# EAGLE design usb2rs485 (EAGLE 5.12)
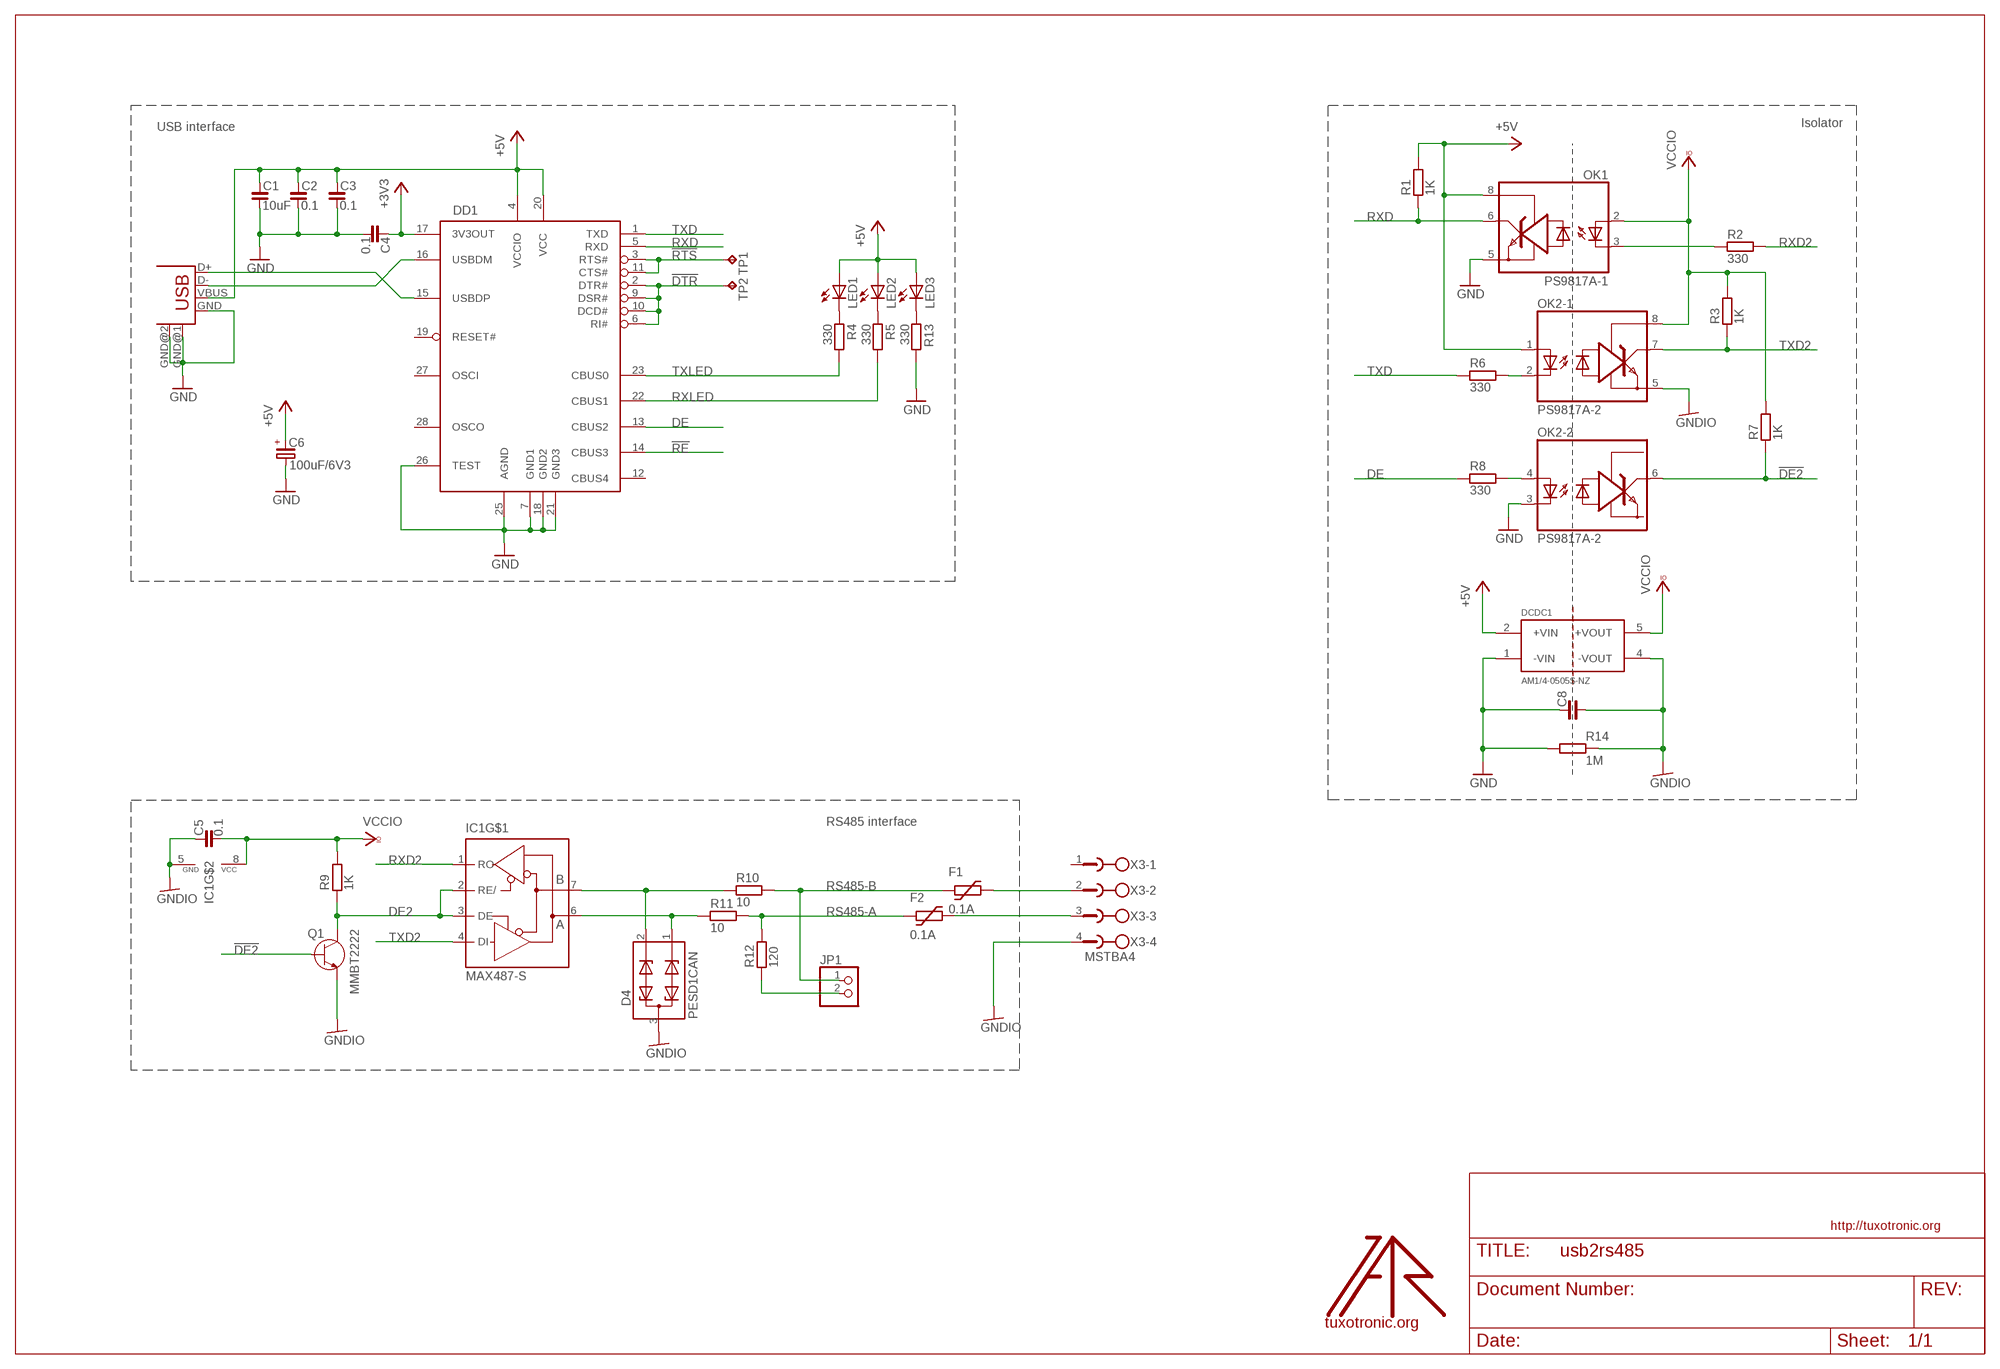
[diagram p0: schematic, sheet 1]

## Parts
C1  10uF  C_0805  [C0805]
C2  0.1  C_0603  [C0603]
C3  0.1  C_0603  [C0603]
C4  0.1  C_0603  [C0603]
C5  0.1  C_0603  [C0603]
C6  100uF/6V3  CP_SMCD  [SMC_D]
C8  C_C050-075X030  [C050-075X030]
D4  PESD1CAN  [SOT23]
DCDC1  AM1/4-0505S-NZ  [AM1/4]
DD1  FT232RL  [SSOP28DB]
F1  0.1A  1812L  [1812L]
F2  0.1A  1812L  [1812L]
IC1  MAX487-S  [SO08]
JP1  PINHD-1X2_2.00  [1X02M]
LED1  LEDCHIP-LED0805  [CHIP-LED0805]
LED2  LEDCHIP-LED0805  [CHIP-LED0805]
LED3  LEDCHIP-LED0805  [CHIP-LED0805]
OK1  PS9817A-1  [SO8F]
OK2  PS9817A-2  [SO8F]
Q1  MMBT2222  [SOT23]
R1  1K  R_0603  [R0603]
R2  330  R_0603  [R0603]
R3  1K  R_0603  [R0603]
R4  330  R_0603  [R0603]
R5  330  R_0603  [R0603]
R6  330  R_0603  [R0603]
R7  1K  R_0603  [R0603]
R8  330  R_0603  [R0603]
R9  1K  R_0603  [R0603]
R10  10  R_0805  [R0805]
R11  10  R_0805  [R0805]
R12  120  R_0805  [R0805]
R13  330  R_0603  [R0603]
R14  1M  R_1206  [R1206]
TP1  TPB1,27  [B1,27]
TP2  TPB1,27  [B1,27]
U$  LOGO  [TT_LOGO]
USB1  USB-B-H  [USB-B-H]
X3  MSTBA4  [MSTBA4]

## Nets
!DE2: OK2.6(-2:COL) Q1.1(B) R7.1
!DTR: DD1.2(DTR#) DD1.6(RI#) DD1.9(DSR#) DD1.10(DCD#) TP2.PP(TP)
!RE: DD1.14(CBUS3)
!RTS: DD1.3(RTS#) DD1.11(CTS#) TP1.PP(TP)
+3V3: C4.1 DD1.17(3V3OUT)
+5V: C1.1 C2.1 C3.1 C6.+ DCDC1.2(+VIN) DD1.4(VCCIO) DD1.20(VCC) LED1.A LED2.A LED3.A OK1.8(VDD) OK2.1(-1:A) R1.2 USB1.VBUS
DE: DD1.13(CBUS2) R8.1
DE2: IC1.2(RE/) IC1.3(DE) Q1.3(C) R9.1
GND: C1.2 C2.2 C3.2 C4.2 C6.- C8.1 DCDC1.1(-VIN) DD1.7(GND1) DD1.18(GND2) DD1.21(GND3) DD1.25(AGND) DD1.26(TEST) OK1.5(GND) OK2.3(-2:C) R13.2 R14.1 USB1.GND USB1.GND@1(GND) USB1.GND@2(GND)
GNDIO: C5.1 C8.2 D4.3 DCDC1.4(-VOUT) IC1.5(GND) OK2.5(-1:GND) Q1.2(E) R14.2 X3.4
N$1: DD1.15(USBDP) USB1.D+
N$2: DD1.16(USBDM) USB1.D-
N$3: LED1.C R4.1
N$4: LED2.C R5.1
N$5: F2.2 X3.3
N$6: F1.2 X3.2
N$7: OK2.4(-2:A) R8.2
N$8: OK2.2(-1:C) R6.2
N$9: OK1.3(C) R2.1
N$11: JP1.2 R12.1
N$15: LED3.C R13.1
N$27: D4.2 IC1.7(B) R10.1
N$28: D4.1 IC1.6(A) R11.1
RS485-A: F2.1 R11.2 R12.2
RS485-B: F1.1 JP1.1 R10.2
RXD: DD1.5(RXD) OK1.6(COL) R1.1
RXD2: IC1.1(RO) R2.2
RXLED: DD1.22(CBUS1) R5.2
TXD: DD1.1(TXD) R6.1
TXD2: IC1.4(DI) OK2.7(-1:COL) R3.1
TXLED: DD1.23(CBUS0) R4.2
VCCIO: C5.2 DCDC1.5(+VOUT) IC1.8(VCC) OK1.2(A) OK2.8(-1:VDD) R3.2 R7.2 R9.2
Unconnected: DD1.12(CBUS4) DD1.19(RESET#) DD1.27(OSCI) DD1.28(OSCO) X3.1

## Notes on the sheet
- Isolator
- USB interface
- RS485 interface

## Library data of the parts
C1-C5 = rc-master-smd:C_: NON-POLARIZED CAP
C6 = rc-master-smd:CP_: POLARIZED CAP
C8 = rc-master:C_: NON-POLARIZED CAP
D4 = protect:PESD1CAN: Features Due to the integrated diode structure only one small SOT23 package is needed to protect two CAN bus lines Max. peak pulse power: PPP = 200 W at tp = 8/20 ?s Low clamping voltage: VCL = 40 V at IPP = 1 A Ultra low leakage current: IRM < 1 nA ESD protection up to 23 kV IEC 61000-4-2, level 4 (ESD) IEC 61000-4-5 (surge); IPP = 3 A at tp = 8/20 ?s Small SMD plastic package Applications CAN bus protection Automotive applications
DCDC1 = dcdc-isolated:AM1/4-: AIMTEC: Series AM1/4L-NZ 1/4 Watt | DC-DC Converter RoHS Compliant SMD Package Low ripple and noise High efficiency up to 68% Operating temperature -40oC to + 85oC Input/Output Isolation 1000 and 3000VDC Pin compatible with multiple manufacturers UL94-VO Package
DD1 = main:FT232RL: USB UART 4th Generation USB UART (USB <-> Serial) Controller
F1 F2 = ptc-littlefuse:1812L
IC1 = interfaces:MAX487: RS485 TRANSEIVER
JP1 = pinhead-fixdrills:PINHD-1X2: PIN HEADER
LED1-LED3 = led:LED: LED OSRAM: - CHIPLED LG R971, LG N971, LY N971, LG Q971, LY Q971, LO R971, LY R971 LH N974, LH R974 LS Q976, LO Q976, LY Q976 LO Q996 - Hyper CHIPLED LW Q18S LB Q993, LB Q99A, LB R99A - SideLED LS A670, LO A670, LY A670, LG A670, LP A670 LB A673, LV A673, LT A673, LW A673 LH A674 LY A675 LS A676, LA A676, LO A676, LY A676, LW A676 LS A679, LY A679, LG A679 - Hyper Micro SIDELED® LS Y876, LA Y876, LO Y876, LY Y876 LT Y87S - SmartLED LW L88C, LW L88S LB L89C, LB L89S, LG L890 LS L89K, LO L89K, LY L89K LS L896, LA L896, LO L896, LY L896 - TOPLED LS T670, LO T670, LY T670, LG T670, LP T670 LSG T670, LSP T670, LSY T670, LOP T670, LYG T670 LG T671, LOG T671, LSG T671 LB T673, LV T673, LT T673, LW T673 LH T674 LS T676, LA T676, LO T676, LY T676, LB T676, LH T676, LSB T676, LW T676 LB T67C, LV T67C, LT T67C, LS T67K, LO T67K, LY T67K, LW E67C LS E67B, LA E67B, LO E67B, LY E67B, LB E67C, LV E67C, LT E67C LW T67C LS T679, LY T679, LG T679 LS T770, LO T770, LY T770, LG T770, LP T770 LB T773, LV T773, LT T773, LW T773 LH T774 LS E675, LA E675, LY E675, LS T675 LS T776, LA T776, LO T776, LY T776, LB T776 LHGB T686 LT T68C, LB T68C - Hyper Mini TOPLED® LB M676 - Mini TOPLED Santana® LG M470 LS M47K, LO M47K, LY M47K Source: http://www.osram.convergy.de - LUMILED® LXK2-PW12-R00, LXK2-PW12-S00, LXK2-PW14-U00, LXK2-PW14-V00 LXK2-PM12-R00, LXK2-PM12-S00, LXK2-PM14-U00 LXK2-PE12-Q00, LXK2-PE12-R00, LXK2-PE12-S00, LXK2-PE14-T00, LXK2-PE14-U00 LXK2-PB12-K00, LXK2-PB12-L00, LXK2-PB12-M00, LXK2-PB14-N00, LXK2-PB14-P00, LXK2-PB14-Q00 LXK2-PR12-L00, LXK2-PR12-M00, LXK2-PR14-Q00, LXK2-PR14-R00 LXK2-PD12-Q00, LXK2-PD12-R00, LXK2-PD12-S00 LXK2-PH12-R00, LXK2-PH12-S00 LXK2-PL12-P00, LXK2-PL12-Q00, LXK2-PL12-R00 Source: www.luxeon.com
OK1 = opto:PS9817A-1: The PS9817A-1 and PS9817A-2 are active-low type high-speed photocouplers that use a GaAlAs light-emitting diode on the input side and a photodetector IC that includes a photodiode and a signal processor on the same chip on the output side.
OK2 = opto:PS9817A-2: The PS9817A-1 and PS9817A-2 are active-low type high-speed photocouplers that use a GaAlAs light-emitting diode on the input side and a photodetector IC that includes a photodiode and a signal processor on the same chip on the output side.
Q1 = semiconductor:MMBT2222: General Purpose Transistors NPN Silicon Rating MMBT2222LT1G MMBT2222ALT1G Collector-Emitter Voltage (VCEO) 30 Vdc 40 Vdc Collector-Base Voltage (VCBO) 60 Vdc 75 Vdc Emitter-Base Voltage (VEBO) 5.0 Vdc 6.0 Vdc Collector Current Continuous (IC) 600 mAdc 1100 mAdc Collector Current Peak (ICM) 600 mAdc 1100 mAdc
R1-R14 = rc-master-smd:R_: RESISTOR
TP1 TP2 = testpad:TP: Test pad
U$ = logo:LOGO
USB1 = main:USB: USB Connectors
X3 = con-phoenix-508:MSTBA4: PHOENIX

## Board
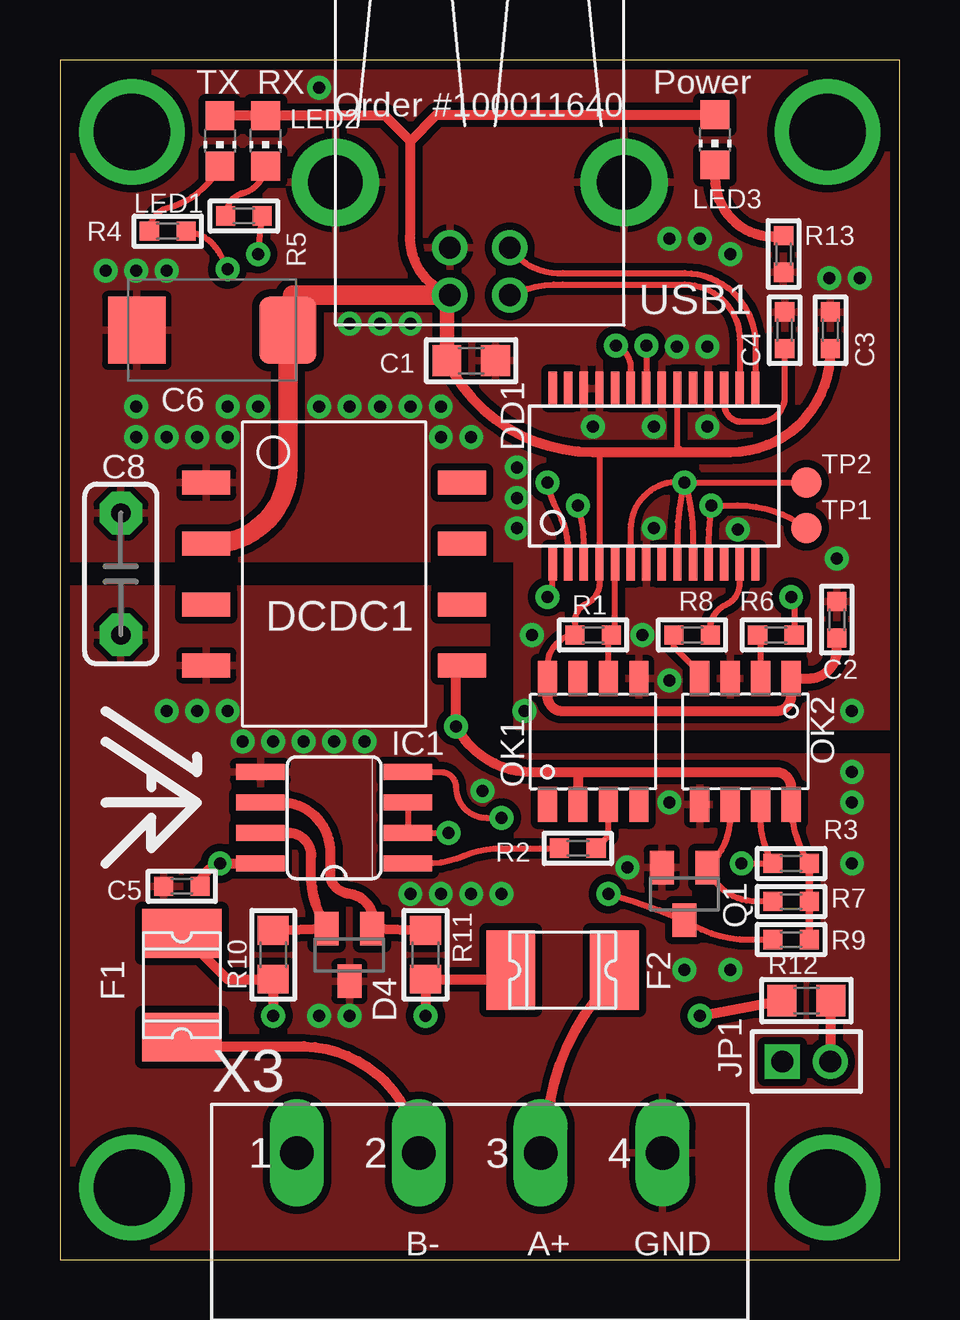
[diagram p1: board, top side]
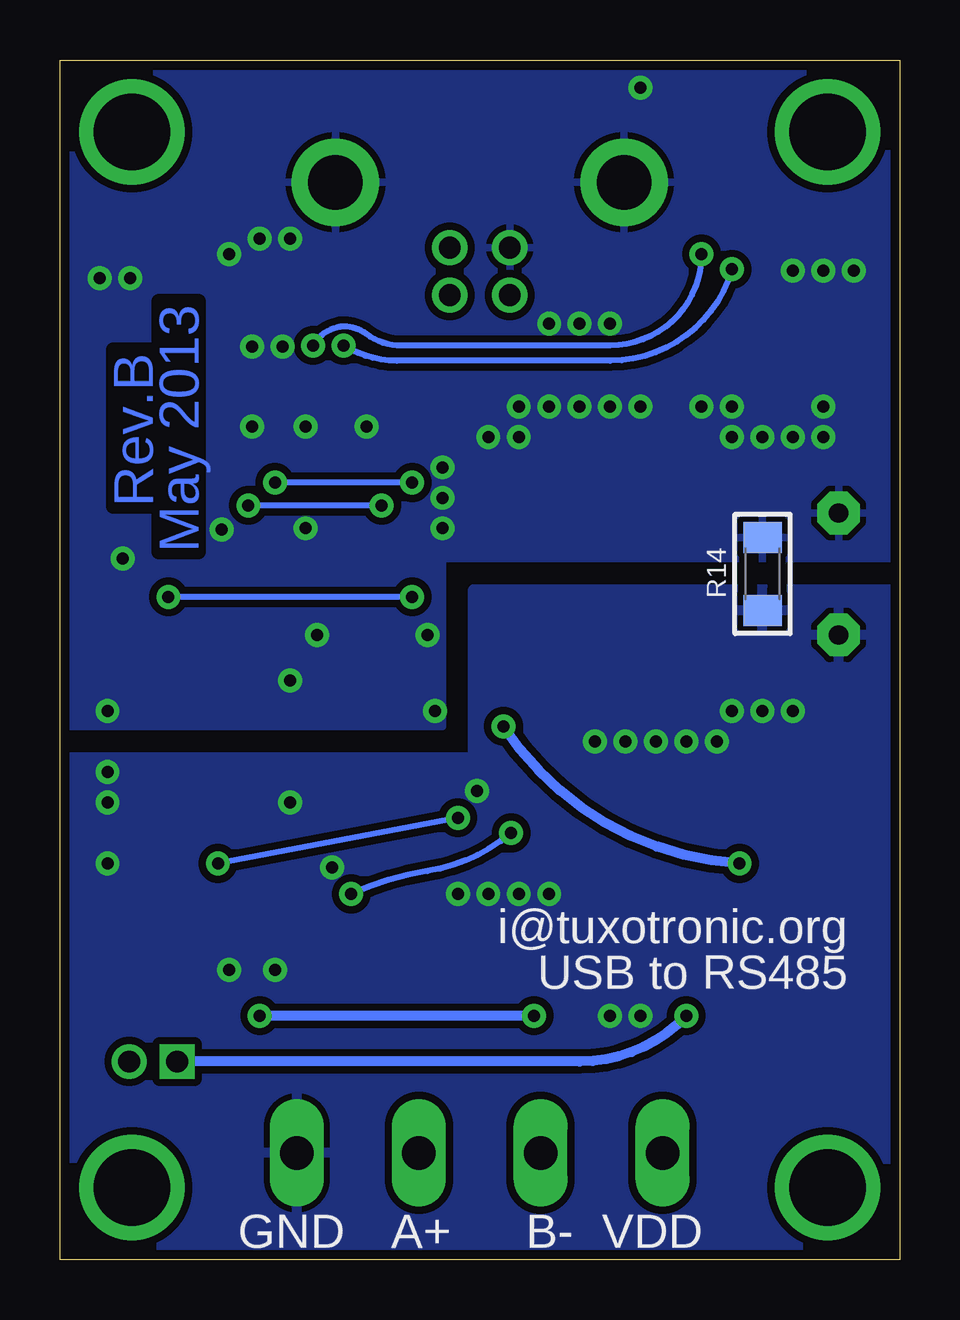
[diagram p2: board, bottom side, seen from below]

Size 35 x 50 mm. Coordinates in mm from the lower left corner, seen from the top.
Outline: 0,0 35,0 35,50 0,50 0,0
Copper layers (1*16): Top 0.018mm / dielectric 1.5011mm / Bottom 0.018mm
Design rules "resonit-speed-18mkm": minimum track width 0.16mm, minimum drill 0.5mm, track to track 0.16mm, track to pad 0.16mm, pad to pad 0.16mm, via to via 0.16mm, smd to smd 0.16mm, copper to edge 0.4mm, drill to drill 8mil, minimum pad ring 0.2489mm, minimum via ring 0.2489mm, stop-mask expansion 4mil, vias tented up to drill 0.5994mm, thermal gap 10mil

### Footprints (pad centres in the part's own frame; a part is rotated, then mirrored left to right if it is on the bottom)
C0805 = smd 1.2 x 1.3: 1 -1.016,0; 2 1.016,0
C0603 = smd 0.8 x 0.8: 1 -0.762,0; 2 0.762,0
SMC_D = smd 2.4 x 2.8: + -3.15,0; - 3.15,0
C050-075X030 = drill 0.8 pad 1.778 octagon: 1 -2.54,0; 2 2.54,0
SOT23 = smd 1 x 1.4: 1 -0.95,-1.1; 2 0.95,-1.1; 3 0,1.1
AM1/4 = smd 1 x 2: 1 -3.81,-5.334; 2 -1.27,-5.334; 3 1.27,-5.334; 4 3.81,-5.334; 5 3.81,5.334; 6 1.27,5.334; 7 -1.27,5.334; 8 -3.81,5.334
SSOP28DB = smd 0.348 x 1.397: 1 -4.225,-3.656; 2 -3.575,-3.656; 3 -2.925,-3.656; 4 -2.275,-3.656; 5 -1.625,-3.656; 6 -0.975,-3.656; 7 -0.325,-3.656; 8 0.325,-3.656; 9 0.975,-3.656; 10 1.625,-3.656; 11 2.275,-3.656; 12 2.925,-3.656; 13 3.575,-3.656; 14 4.225,-3.656; 15 4.225,3.656; 16 3.575,3.656; 17 2.925,3.656; 18 2.275,3.656; 19 1.625,3.656; 20 0.975,3.656; 21 0.325,3.656; 22 -0.325,3.656; 23 -0.975,3.656; 24 -1.625,3.656; 25 -2.275,3.656; 26 -2.925,3.656; 27 -3.575,3.656; 28 -4.225,3.656
1812L = smd 2.03 x 3.3: 1 -2.16,0; 2 2.16,0
SO08 = smd 0.66 x 2.032: 1 -1.905,-3.073; 2 -0.635,-3.073; 3 0.635,-3.073; 4 1.905,-3.073; 5 1.905,3.073; 6 0.635,3.073; 7 -0.635,3.073; 8 -1.905,3.073
1X02M = drill 0.9 square: 1 -1,0 | drill 0.9 round: 2 1,0
CHIP-LED0805 = smd 1.2 x 1.2: A 0,-1.05; C 0,1.05
SO8F = smd 0.8 x 1.45: 1 -1.905,-2.625; 2 -0.635,-2.625; 3 0.635,-2.625; 4 1.905,-2.625; 5 1.905,2.625; 6 0.635,2.625; 7 -0.635,2.625; 8 -1.905,2.625
R0603 = smd 0.8 x 0.8: 1 -0.762,0; 2 0.762,0
R0805 = smd 1.2 x 1.3: 1 -1.016,0; 2 1.016,0
R1206 = smd 1.3 x 1.6: 1 -1.524,0; 2 1.524,0
B1,27 = smd 1.27 x 1.27: PP 0,0
USB-B-H = drill 0.914 round: D+ 0,1.25; D- 1.981,1.25; GND 0,-1.25; VBUS 1.981,-1.25 | drill 2.286 round: GND@1 -2.718,6.02; GND@2 -2.718,-6.02
MSTBA4 = drill 1.4 long: 1 -7.62,5.08; 2 -2.54,5.08; 3 2.54,5.08; 4 7.62,5.08

### Placement (x,y rotation side)
C1  17.14,37.47 0 top
C2  32.38,26.67 90 top
C3  32.12,38.73 90 top
C4  30.21,38.73 90 top
C5  5.08,15.56 0 top
C6  6.35,38.73 180 top
C8  2.54,28.57 270 top
D4  12.06,12.7 180 top
DCDC1  11.43,28.57 270 top
DD1  24.77,32.66 0 top
F1  5.08,11.43 270 top
F2  20.95,12.06 0 top
IC1  11.43,18.41 90 top
JP1  31.11,8.26 0 top
LED1  6.67,46.62 180 top
LED2  8.57,46.62 180 top
LED3  27.3,46.67 180 top
OK1  22.23,21.59 0 top
OK2  28.57,21.59 180 top
Q1  26.04,15.24 180 top
R1  22.23,26.04 180 top
R2  21.59,17.14 180 top
R3  30.48,16.51 0 top
R4  4.49,42.86 0 top
R5  7.67,43.5 0 top
R6  29.84,26.04 180 top
R7  30.48,14.92 0 top
R8  26.35,26.04 180 top
R9  30.48,13.34 0 top
R10  8.89,12.7 270 top
R11  15.24,12.7 270 top
R12  31.11,10.79 180 top
R13  30.16,41.91 270 top
R14  5.71,28.57 270 bottom
TP1  31.11,30.48 270 top
TP2  31.11,32.38 270 top
U$  4.45,19.05 270 top
USB1  17.5,42.18 270 top
X3  17.5,-0.64 0 top

### Tracks (layer width: path | path; a pad name or v marks a point on that pad's centre or on a via)
!DE2
  Top 0.254: R7.1 29.04,14.92 arc-69 Q1.1 arc49 27.94,18.41 OK2.6
!DTR  (via drill 0.5)
  Top 0.254: DD1.2 21.19,29.61 arc29 20.8,31.11 arc-18 v20.32,32.38 | DD1.10 26.39,30.12 arc18 v26.04,32.38 | DD1.9 25.74,30.18 arc-15 v26.04,32.38 | DD1.6 23.79,30.46 arc-99 v26.04,32.38 | v26.04,32.38 TP2.PP
  Bottom 0.254: v20.32,32.38 v26.04,32.38
!RTS  (via drill 0.5)
  Top 0.254: DD1.3 21.84,29.91 arc19 v21.59,31.43 | DD1.11 27.04,29.9 arc-8 v27.15,31.43 28.26,31.43 arc-37 TP1.PP
  Bottom 0.254: v21.59,31.43 v27.15,31.43
+3V3
  Top 0.254: DD1.17 27.69,35.65 arc90 28.42,34.92 29.21,34.92 arc96 30.21,36.04 C4.1
+5V
  Top 0.254: OK1.8 20.32,24.77 arc-84 R1.2 21.46,26.54 arc-71 21.91,27.3 arc66 22.49,28.2 DD1.4 22.49,33.55 22.38,33.66 | DD1.20 25.74,33.84 26.04,33.66
  Top 0.406: 14.61,46.62 14.61,42.81 arc73 USB1.VBUS | 14.61,46.62 13.55,47.67 LED2.A LED1.A | OK1.8 20.32,23.5 arc90 20.95,22.86 29.84,22.86 arc90 30.48,23.5 OK2.1 31.2,24.21 arc90 32.38,25.4 C2.1 | LED3.A 15.7,47.72 14.61,46.62 | C1.1 arc64 22.23,33.66 22.38,33.66 26.04,33.66 27.94,33.66 arc92 C3.1
  Top 0.61: C1.1 16.13,39.8 USB1.VBUS
  Top 0.813: DCDC1.2 6.35,29.84 arc90 9.5,32.99 C6.+ 9.69,40.2 USB1.VBUS
DE
  Top 0.254: DD1.13 28.34,28.18 arc-65 27.78,27.3 arc75 R8.1
DE2  (via drill 0.5)
  Top 0.254: IC1.3 IC1.2 v16.19,17.78 | R9.1 28.75,13.34 arc-33 Q1.3 arc8 v22.86,15.24
  Bottom 0.254: v16.19,17.78 arc31 19.68,16.19 arc-16 v22.86,15.24
GND  (via drill 0.5)
  other vias: 22.23,34.72 26.99,34.72 32.07,40.91 1.91,41.23 24.29,26.04 25.4,24.13 32.38,29.21 19.05,30.48 33.02,22.86 3.17,35.56 33.34,40.91 3.17,41.23 14.61,39.01 4.45,41.23 25.72,38.05 26.99,38.05 28.26,30.43 6.99,34.29 5.71,34.29 3.17,34.29 4.45,34.29 24.77,30.48 24.77,34.72 15.88,35.56 15.88,34.29 17.14,34.29 19.05,31.75 19.05,33.02 19.37,22.86 19.68,26.04 13.34,39.01 12.06,39.01 14.61,35.56 13.34,35.56 12.06,35.56 10.79,35.56 8.26,35.56 6.99,35.56 27.94,41.91 26.67,42.55 25.4,42.55 10.79,48.85
  pour Top (isolate 0.305): -0.64,51.07 36.2,51.07 36.2,22.23 19.05,22.23 19.05,29.21 -0.64,29.21
  pour Bottom (isolate 0.305): -0.64,50.44 36.2,50.44 36.2,22.23 19.05,22.23 19.05,29.21 -0.64,29.21
GNDIO  (via drill 0.5)
  other vias: 25.4,19.05 14.61,15.24 6.99,22.86 23.65,16.35 5.71,22.86 4.45,22.86 10.16,21.59 15.88,15.24 17.14,15.24 18.41,15.24 17.62,19.53 11.43,21.59 12.7,21.59 12.06,10.16 10.79,10.16 26.04,12.06 27.94,12.06 33.02,19.05 33.02,16.51 8.89,21.59 7.62,21.59 33.02,20.32
  pour Top (isolate 0.305): -0.64,-0.64 36.2,-0.64 36.2,20.95 17.78,20.95 17.78,27.94 -0.64,27.94
  pour Bottom (isolate 0.305): -0.64,-0.64 36.2,-0.64 36.2,20.95 17.78,20.95 17.78,27.94 -0.64,27.94
N$1
  Top 0.254: DD1.15 28.99,38.1 arc91 26.04,41.12 20.95,41.12 arc-58 USB1.D+
N$2
  Top 0.254: DD1.16 28.34,38.34 arc90 26.04,40.64 20.95,40.64 arc26 USB1.D-
N$3
  Top 0.254: R4.1 3.81,43.18 arc-62 4.45,43.81 arc49 LED1.C
N$4
  Top 0.254: R5.1 6.99,43.81 arc-62 7.62,44.45 arc71 LED2.C
N$5
  Top 0.406: X3.3 20.32,5.08 arc-44 22.86,11.43 arc43 F2.2
N$6
  Top 0.406: F1.2 4.19,9.53 4.45,9.53 5.08,8.89 10.16,8.89 arc-82 X3.2
N$7
  Top 0.254: OK2.4 26.67,24.45 25.59,25.53 R8.2
N$8
  Top 0.254: OK2.2 29.21,25.91 R6.2
N$9
  Top 0.254: OK1.3 22.86,17.65 R2.1
N$10  (via drill 3.2)
  other vias: 32,47
N$11
  Top 0.406: R12.1 32.13,8.91 JP1.2
N$12  (via drill 3.2)
  other vias: 3,47
N$13  (via drill 3.2)
  other vias: 3,3
N$14  (via drill 3.2)
  other vias: 32,3
N$15
  Top 0.406: LED3.C 27.3,45.09 arc100 R13.1
N$27
  Top 0.406: IC1.7 9.53,17.78 arc-90 10.48,16.83 10.48,15.88 arc26 D4.2 R10.1
N$28
  Top 0.406: IC1.6 9.21,19.05 arc-85 11.27,17.14 11.27,15.88 arc64 12.06,15.24 arc-100 D4.1 R11.1
RS485-A  (via drill 0.5)
  Top 0.406: F2.1 18.41,11.68 R11.2 v15.24,10.16 | v26.67,10.16 R12.2
  Bottom 0.406: v15.24,10.16 v26.67,10.16
RS485-B  (via drill 0.5)
  Top 0.406: F1.1 6.99,11.68 R10.2 v8.89,10.16
  Bottom 0.406: v8.89,10.16 arc46 13.34,8.26 JP1.1
RXD
  Top 0.254: DD1.5 23.14,26.19 R1.1 22.86,25.91 OK1.6
RXD2
  Top 0.254: R2.2 18.41,17.14 arc23 16.83,16.83 arc-23 15.24,16.51 IC1.1
RXLED  (via drill 0.5)
  Top 0.254: DD1.22 v24.44,38.09 v24.45,38.1 | v8.26,41.91 R5.2
  Bottom 0.254: v24.45,38.1 arc56 23.18,38.89 arc37 22.23,38.58 arc-33 20.95,38.1 12.06,38.1 arc-90 v8.26,41.91
TXD  (via drill 0.5)
  Top 0.254: R6.1 30.61,27.5 v30.48,27.62 | DD1.1 20.54,27.84 v20.32,27.62
  Bottom 0.254: v20.32,27.62 v30.48,27.62
TXD2  (via drill 0.5)
  Top 0.254: v28.42,16.51 R3.1 arc-30 29.21,18.41 | v18.41,18.41 17.78,18.41 arc-90 16.51,19.68 arc90 15.88,20.32 IC1.4
  Top 0.305: 29.21,18.41 OK2.7
  Bottom 0.254: v28.42,16.51 | v18.41,18.41 v28.42,16.51
TXLED  (via drill 0.5)
  Top 0.254: DD1.23 23.79,37.17 arc67 v23.18,38.1 | v6.99,41.27 6.67,41.91 arc59 R4.2
  Bottom 0.254: v23.18,38.1 arc-32 20.95,37.47 12.06,37.47 arc-74 v6.99,41.27
VCCIO  (via drill 0.5)
  Top 0.254: OK2.8 arc34 R3.2
  Top 0.305: R3.2 R7.2 R9.2
  Top 0.406: OK2.8 30.48,19.68 arc90 29.84,20.32 21.59,20.32 | 21.59,20.32 OK1.2 | 21.59,20.32 19.68,20.32 arc-62 v16.51,22.23 16.51,24.51 DCDC1.5 | IC1.8 v6.67,16.51 arc59 5.84,15.68 C5.2
  Bottom 0.406: v6.67,16.51 arc53 v16.51,22.23

### Text on the board
Bottom: Rev.B | May 2013
tPlace: Order #100011640
tNames: TX | RX | Power | B- | A+ | GND
bNames: i@tuxotronic.org | USB to RS485 | VDD | B- | A+ | GND